# Altium project 智能配送c8t6.PrjPcb
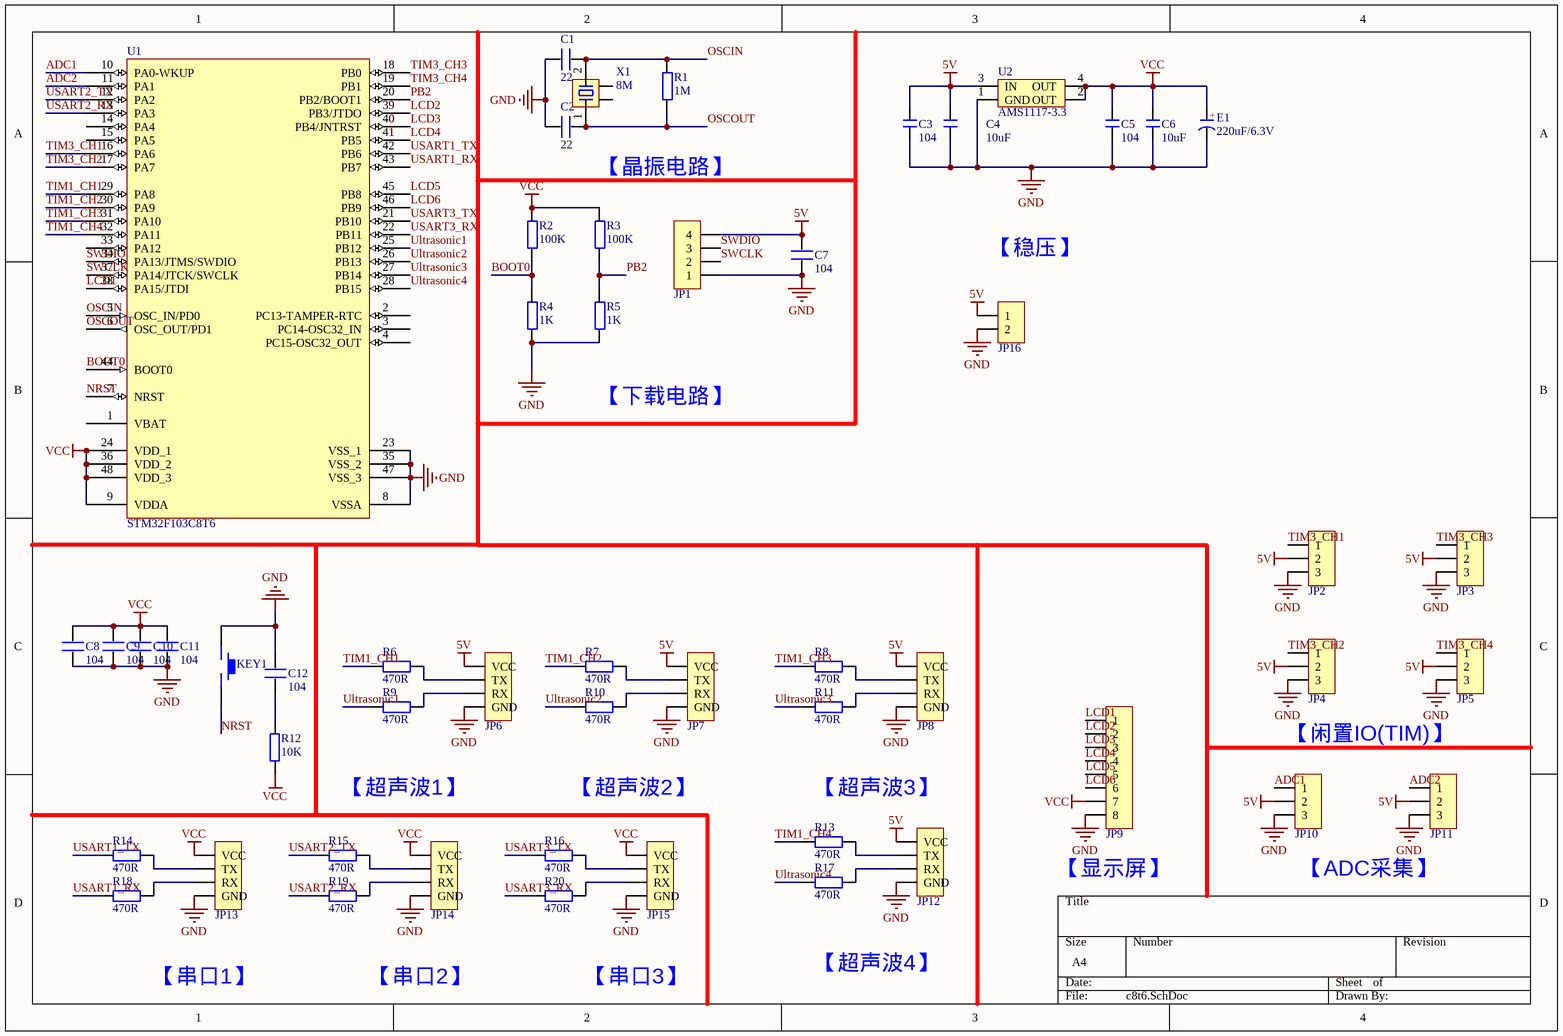
[diagram p0: c8t6.SchDoc]
1 sheet, 53 parts. Net scope: global (net labels, ports and power ports of the same name join across sheets).
Board file: C8T6.PcbDoc

## Sheet c8t6.SchDoc
size A4

### Parts
C1  22  [C 0603]
C2  22  [C 0603]
C3  104  [C 0603]
C4  10uF  [C 0805]
C5  104  [C 0603]
C6  10uF  [C 0805]
C7  104  [C 0603]
C8  104  [C 0603]
C9  104  [C 0603]
C10  104  [C 0603]
C11  104  [C 0603]
C12  104  [C 0603]
E1  220uF/6.3V  [CD C(6032)]
JP1  HDR-1X4  [XH2.54-4P]  (value not drawn)
JP2  HDR-1X3  [HDR-1X3]  (value not drawn)
JP3  HDR-1X3  [HDR-1X3]  (value not drawn)
JP4  HDR-1X3  [HDR-1X3]  (value not drawn)
JP5  HDR-1X3  [HDR-1X3]  (value not drawn)
JP6  HDR-1X4  [XH2.54-4P]  (value not drawn)
JP7  HDR-1X4  [XH2.54-4P]  (value not drawn)
JP8  HDR-1X4  [XH2.54-4P]  (value not drawn)
JP9  HDR-1X8  [HDR-1X8]  (value not drawn)
JP10  HDR-1X3  [HDR-1X3]  (value not drawn)
JP11  HDR-1X3  [HDR-1X3]  (value not drawn)
JP12  HDR-1X4  [XH2.54-4P]  (value not drawn)
JP13  HDR-1X4  [XH2.54-4P]  (value not drawn)
JP14  HDR-1X4  [XH2.54-4P]  (value not drawn)
JP15  HDR-1X4  [XH2.54-4P]  (value not drawn)
JP16  HDR-1X2  [XT60]  (value not drawn)
KEY1  KEY_M  [TSW DIP-3*6*4.3]  (value not drawn)
R1  1M  [R 0603]
R2  100K  [R 0603]
R3  100K  [R 0603]
R4  1K  [R 0603]
R5  1K  [R 0603]
R6  470R  [R 0603]
R7  470R  [R 0603]
R8  470R  [R 0603]
R9  470R  [R 0603]
R10  470R  [R 0603]
R11  470R  [R 0603]
R12  10K  [R 0603]
R13  470R  [R 0603]
R14  470R  [R 0603]
R15  470R  [R 0603]
R16  470R  [R 0603]
R17  470R  [R 0603]
R18  470R  [R 0603]
R19  470R  [R 0603]
R20  470R  [R 0603]
U1  STM32F103C8T6  [LQFP48 7X7_M]
U2  AMS1117-3.3  [SOT223_L]
X1  8M  [XTAL-49S DIP]

### Nets
5V: C3.2 C4.2 C7.1 JP1.4 JP2.2 JP3.2 JP4.2 JP5.2 JP6.1(VCC) JP7.1(VCC) JP8.1(VCC) JP10.2 JP11.2 JP12.1(VCC) JP16.1 U2.3(IN)
GND: C1.2 C2.2 C3.1 C4.1 C5.1 C6.1 C7.2 C8.2 C9.2 C10.2 C11.2 C12.2 E1.2(K) JP1.1 JP2.3 JP3.3 JP4.3 JP5.3 JP6.4(GND) JP7.4(GND) JP8.4(GND) JP9.8 JP10.3 JP11.3 JP12.4(GND) JP13.4(GND) JP14.4(GND) JP15.4(GND) JP16.2 KEY1.1 R4.1 R5.1 U1.8(VSSA) U1.23(VSS_1) U1.35(VSS_2) U1.47(VSS_3) U2.1(GND)
VCC: C5.2 C6.2 C8.1 C9.1 C10.1 C11.1 E1.1(A) JP9.7 JP13.1(VCC) JP14.1(VCC) JP15.1(VCC) R2.2 R3.2 R12.2 U1.9(VDDA) U1.24(VDD_1) U1.36(VDD_2) U1.48(VDD_3) U2.2(OUT) U2.4(OUT)
ADC1: JP10.1 U1.10(PA0-WKUP)
ADC2: JP11.1 U1.11(PA1)
BOOT0: R2.1 R4.2 U1.44(BOOT0)
LCD1: JP9.1 U1.38(PA15/JTDI)
LCD2: JP9.2 U1.39(PB3/JTDO)
LCD3: JP9.3 U1.40(PB4/JNTRST)
LCD4: JP9.4 U1.41(PB5)
LCD5: JP9.5 U1.45(PB8)
LCD6: JP9.6 U1.46(PB9)
NRST: KEY1.2 U1.7(NRST)
OSCIN: C1.1 R1.2 U1.5(OSC_IN/PD0) X1.2
OSCOUT: C2.1 R1.1 U1.6(OSC_OUT/PD1) X1.1
PB2: R3.1 R5.2 U1.20(PB2/BOOT1)
SWCLK: JP1.2 U1.37(PA14/JTCK/SWCLK)
SWDIO: JP1.3 U1.34(PA13/JTMS/SWDIO)
TIM1_CH1: R6.1 U1.29(PA8)
TIM1_CH2: R7.1 U1.30(PA9)
TIM1_CH3: R8.1 U1.31(PA10)
TIM1_CH4: R13.1 U1.32(PA11)
TIM3_CH1: JP2.1 U1.16(PA6)
TIM3_CH2: JP4.1 U1.17(PA7)
TIM3_CH3: JP3.1 U1.18(PB0)
TIM3_CH4: JP5.1 U1.19(PB1)
Ultrasonic1: R9.1 U1.25(PB12)
Ultrasonic2: R10.1 U1.26(PB13)
Ultrasonic3: R11.1 U1.27(PB14)
Ultrasonic4: R17.1 U1.28(PB15)
USART1_RX: R18.1 U1.43(PB7)
USART1_TX: R14.1 U1.42(PB6)
USART2_RX: R19.1 U1.13(PA3)
USART2_TX: R15.1 U1.12(PA2)
USART3_RX: R20.1 U1.22(PB11)
USART3_TX: R16.1 U1.21(PB10)
NetC12_1: C12.1 R12.1
NetJP6_2: JP6.2(TX) R6.2
NetJP6_3: JP6.3(RX) R9.2
NetJP7_2: JP7.2(TX) R7.2
NetJP7_3: JP7.3(RX) R10.2
NetJP8_2: JP8.2(TX) R8.2
NetJP8_3: JP8.3(RX) R11.2
NetJP12_2: JP12.2(TX) R13.2
NetJP12_3: JP12.3(RX) R17.2
NetJP13_2: JP13.2(TX) R14.2
NetJP13_3: JP13.3(RX) R18.2
NetJP14_2: JP14.2(TX) R15.2
NetJP14_3: JP14.3(RX) R19.2
NetJP15_2: JP15.2(TX) R16.2
NetJP15_3: JP15.3(RX) R20.2

Not connected (* = marked no-connect by the designer): U1 1(VBAT) 2(PC13-TAMPER-RTC) 3(PC14-OSC32_IN) 4(PC15-OSC32_OUT) 14(PA4) 15(PA5) 33(PA12); X1 3(2) 4

### Notes on the sheet
- 【晶振电路】
- 【稳压】
- 【下载电路】
- 【闲置IO(TIM)】
- 【超声波1】
- 【超声波2】
- 【超声波3】
- (near JP9) 【显示屏】
- 【ADC采集】
- 【串口1】
- 【串口2】
- 【串口3】
- 【超声波4】
- (in symbol C-CD) +

### Library data of the parts
C1 C2 C7-C12 = C
C3-C6 = C: 无极性贴片电容; 版权归属: 源创客; BOM名称: 无极性贴片电容; 学习资源: www.ooocke.com
E1 = C-CD: 贴片钽电容; 版权归属: 源创客; BOM名称: 贴片钽电容; 学习资源: www.ooocke.com
JP1 JP6-JP8 JP12-JP15 = Header 4: 4P接插件; 版权归属: 源创客; BOM名称: 4P接插件; 学习资源: www.ooocke.com
JP2-JP5 JP10 JP11 = Header 3: 3P接插件; 版权归属: 源创客; BOM名称: 3P接插件; 学习资源: www.ooocke.com
JP9 = Header 8: 8P接插件; 版权归属: 源创客; BOM名称: 8P接插件; 学习资源: www.ooocke.com
JP16 = Header 2: 2P接插件; 版权归属: 源创客; BOM名称: 2P接插件; 学习资源: www.ooocke.com
R1-R5 R12 = R
R6-R11 R13-R20 = R: 贴片电阻; 版权归属: 源创客; BOM名称: 贴片电阻; 学习资源: www.ooocke.com
U1 = STM32F103C8T6: Flaah:64/RAM:20/IO:36; BOM名称: 32位STM单片机; 版权归属: 源创客; 学习资源: www.ooocke.com
U2 = AMS1117
X1 = XTAL-4: 4脚晶振; 版权归属: 源创客; BOM名称: 4脚晶振; 学习资源: www.ooocke.com